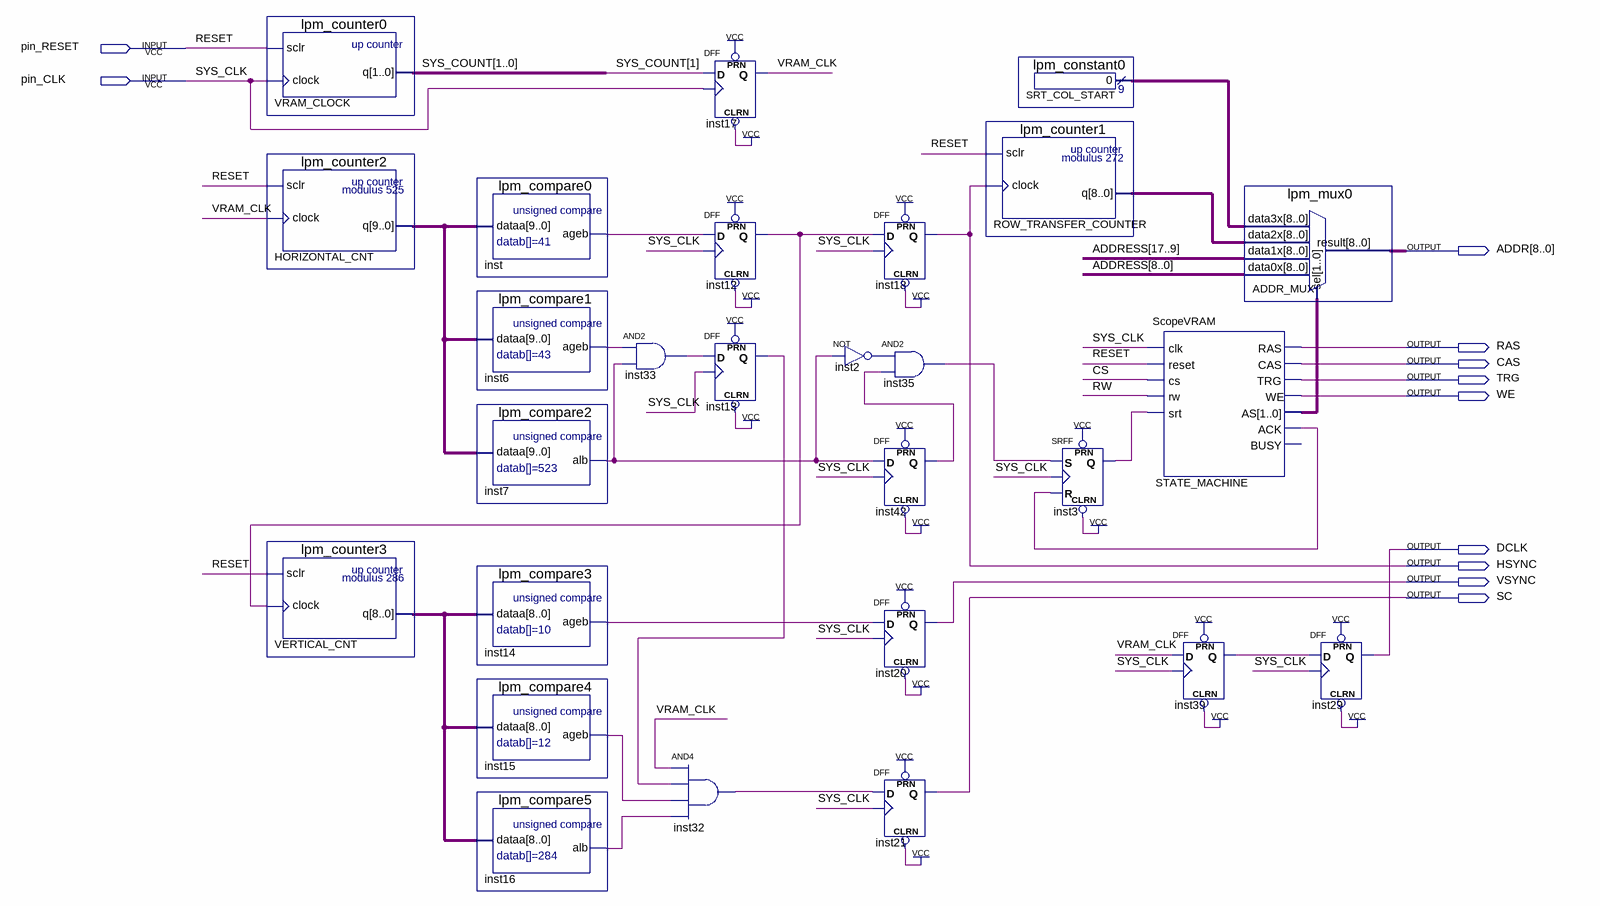
[diagram p0: schematic sheet]
// Quartus schematic oscilloscope.bdf as structural Verilog: 27 symbols, 11 pins
module oscilloscope (
  input  pin_RESET,
  input  pin_CLK,
  output [8:0] ADDR,
  output RAS,
  output CAS,
  output TRG,
  output WE,
  output DCLK,
  output HSYNC,
  output VSYNC,
  output SC
);

  wire CS, inst2_out, inst3_q, inst6_ageb, inst7_alb, inst12_q, inst13_q, inst14_ageb, inst15_ageb,
       inst16_alb, inst32_out, inst33_out, inst35_out, inst39_q, inst42_q, inst_ageb, RW, STATE_MACHINE_ack,
       VRAM_CLK;
  wire [1:0] STATE_MACHINE_as, SYS_COUNT;
  wire [8:0] ROW_TRANSFER_COUNTER_q, SRT_COL_START_result, VERTICAL_CNT_q;
  wire [9:0] HORIZONTAL_CNT_q;
  wire [17:0] ADDRESS;

  lpm_counter0 VRAM_CLOCK (.sclr(pin_RESET), .clock(pin_CLK), .q(SYS_COUNT));
  lpm_counter2 HORIZONTAL_CNT (.sclr(pin_RESET), .clock(VRAM_CLK), .q(HORIZONTAL_CNT_q));
  lpm_counter3 VERTICAL_CNT (.sclr(pin_RESET), .clock(inst12_q), .q(VERTICAL_CNT_q));
  lpm_compare0 inst (.dataa(HORIZONTAL_CNT_q), .ageb(inst_ageb));
  lpm_compare1 inst6 (.dataa(HORIZONTAL_CNT_q), .ageb(inst6_ageb));
  lpm_compare2 inst7 (.dataa(HORIZONTAL_CNT_q), .alb(inst7_alb));
  lpm_compare3 inst14 (.dataa(VERTICAL_CNT_q), .ageb(inst14_ageb));
  lpm_compare4 inst15 (.dataa(VERTICAL_CNT_q), .ageb(inst15_ageb));
  lpm_compare5 inst16 (.dataa(VERTICAL_CNT_q), .alb(inst16_alb));
  and inst33 (inst33_out, inst6_ageb, inst7_alb);
  and inst32 (inst32_out, VRAM_CLK, inst13_q, inst15_ageb, inst16_alb);
  DFF inst17 (.CLRN(1'b1), .CLK(pin_CLK), .D(SYS_COUNT[1]), .PRN(1'b1), .Q(VRAM_CLK));
  DFF inst12 (.CLRN(1'b1), .CLK(pin_CLK), .D(inst_ageb), .PRN(1'b1), .Q(inst12_q));
  DFF inst13 (.CLRN(1'b1), .CLK(pin_CLK), .D(inst33_out), .PRN(1'b1), .Q(inst13_q));
  not inst2 (inst2_out, inst7_alb);
  DFF inst18 (.CLRN(1'b1), .CLK(pin_CLK), .D(inst12_q), .PRN(1'b1), .Q(HSYNC));
  and inst35 (inst35_out, inst2_out, inst42_q);
  DFF inst42 (.CLRN(1'b1), .CLK(pin_CLK), .D(inst7_alb), .PRN(1'b1), .Q(inst42_q));
  DFF inst20 (.CLRN(1'b1), .CLK(pin_CLK), .D(inst14_ageb), .PRN(1'b1), .Q(VSYNC));
  DFF inst21 (.CLRN(1'b1), .CLK(pin_CLK), .D(inst32_out), .PRN(1'b1), .Q(SC));
  lpm_counter1 ROW_TRANSFER_COUNTER (.sclr(pin_RESET), .clock(HSYNC), .q(ROW_TRANSFER_COUNTER_q));
  lpm_constant0 SRT_COL_START (.result(SRT_COL_START_result));
  SRFF inst3 (.PRN(1'b1), .CLRN(1'b1), .S(inst35_out), .R(STATE_MACHINE_ack), .CLK(pin_CLK), .Q(inst3_q));
  ScopeVRAM STATE_MACHINE (
    .clk(pin_CLK), .reset(pin_RESET), .cs(CS), .rw(RW), .srt(inst3_q), .RAS(RAS), .CAS(CAS), .TRG(TRG),
    .WE(WE), .AS(STATE_MACHINE_as), .ACK(STATE_MACHINE_ack));  // open: BUSY
  DFF inst39 (.CLRN(1'b1), .CLK(pin_CLK), .D(VRAM_CLK), .PRN(1'b1), .Q(inst39_q));
  lpm_mux0 ADDR_MUX (
    .data3x(SRT_COL_START_result), .data2x(ROW_TRANSFER_COUNTER_q), .data1x(ADDRESS[17:9]),
    .data0x(ADDRESS[8:0]), .sel(STATE_MACHINE_as), .result(ADDR));
  DFF inst29 (.CLRN(1'b1), .CLK(pin_CLK), .D(inst39_q), .PRN(1'b1), .Q(DCLK));

  // Other names for the same wires on the sheet: RESET = pin_RESET; SYS_CLK = pin_CLK
endmodule
